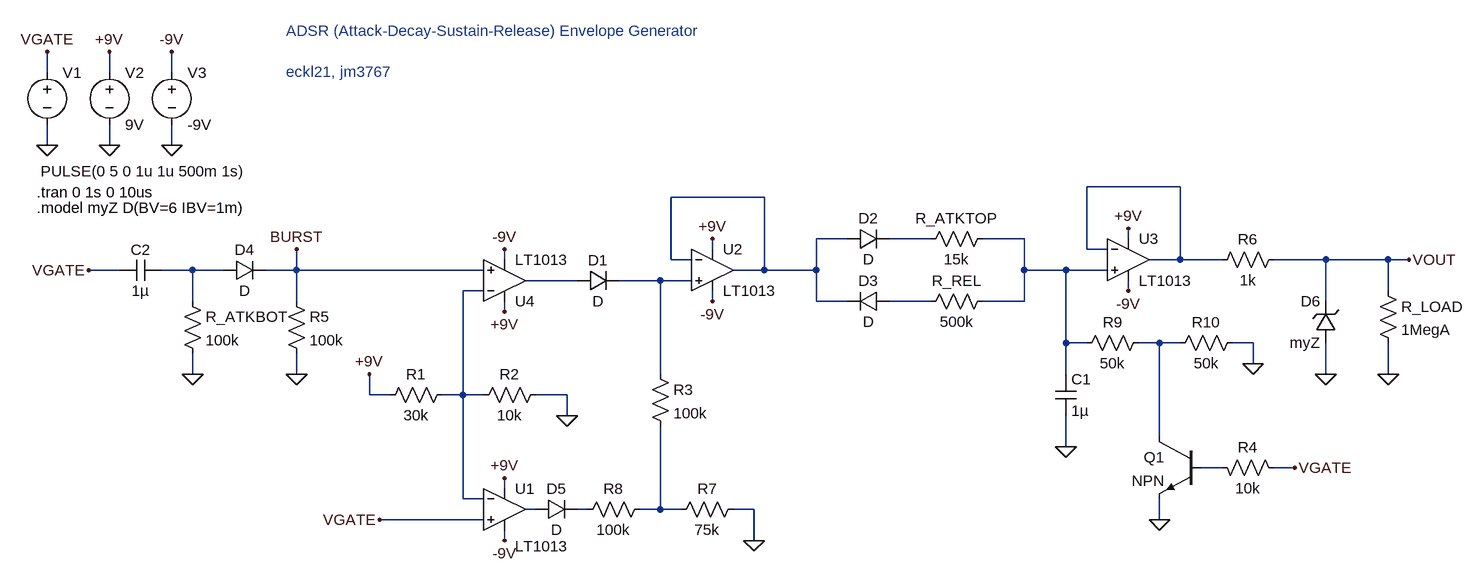
[diagram p0: schematic 260307-Synthesizer-EEE-ADSRENV-v3-00.asc]
260307-Synthesizer-EEE-ADSRENV-v3-00.asc, the LTspice schematic file:
Version 4.1
SHEET 1 2440 680
WIRE 48 -320 48 -352
WIRE 144 -320 144 -352
WIRE 240 -320 240 -352
WIRE 48 -208 48 -240
WIRE 144 -208 144 -240
WIRE 240 -208 240 -240
WIRE 1792 -144 1648 -144
WIRE 1152 -128 1008 -128
WIRE 1280 -64 1232 -64
WIRE 1408 -64 1344 -64
WIRE 1552 -64 1488 -64
WIRE 1712 -64 1712 -80
WIRE 1072 -48 1072 -64
WIRE 1648 -48 1648 -144
WIRE 1680 -48 1648 -48
WIRE 752 -32 752 -48
WIRE 1008 -32 1008 -128
WIRE 1040 -32 1008 -32
WIRE 1792 -32 1792 -144
WIRE 1792 -32 1744 -32
WIRE 1856 -32 1792 -32
WIRE 2016 -32 1936 -32
WIRE 2112 -32 2016 -32
WIRE 2144 -32 2112 -32
WIRE 160 -16 112 -16
WIRE 272 -16 224 -16
WIRE 320 -16 272 -16
WIRE 432 -16 432 -48
WIRE 432 -16 384 -16
WIRE 720 -16 432 -16
WIRE 1152 -16 1152 -128
WIRE 1152 -16 1104 -16
WIRE 1232 -16 1232 -64
WIRE 1232 -16 1152 -16
WIRE 1552 -16 1552 -64
WIRE 1616 -16 1552 -16
WIRE 1680 -16 1616 -16
WIRE 864 0 784 0
WIRE 992 0 928 0
WIRE 1040 0 992 0
WIRE 720 16 688 16
WIRE 1712 16 1712 0
WIRE 2112 16 2112 -32
WIRE 272 32 272 -16
WIRE 432 32 432 -16
WIRE 1072 32 1072 16
WIRE 1232 32 1232 -16
WIRE 1280 32 1232 32
WIRE 1408 32 1344 32
WIRE 1552 32 1552 -16
WIRE 1552 32 1488 32
WIRE 2016 32 2016 -32
WIRE 752 48 752 32
WIRE 1616 96 1616 -16
WIRE 1648 96 1616 96
WIRE 1760 96 1728 96
WIRE 1792 96 1760 96
WIRE 1904 96 1872 96
WIRE 1904 128 1904 96
WIRE 272 144 272 112
WIRE 432 144 432 112
WIRE 992 144 992 0
WIRE 1616 144 1616 96
WIRE 2016 144 2016 96
WIRE 2112 144 2112 96
WIRE 544 176 544 144
WIRE 576 176 544 176
WIRE 688 176 688 16
WIRE 688 176 656 176
WIRE 720 176 688 176
WIRE 848 176 800 176
WIRE 848 208 848 176
WIRE 1760 240 1760 96
WIRE 1616 256 1616 208
WIRE 1856 288 1824 288
WIRE 1968 288 1936 288
WIRE 752 320 752 304
WIRE 688 336 688 176
WIRE 720 336 688 336
WIRE 800 352 784 352
WIRE 880 352 864 352
WIRE 992 352 992 224
WIRE 992 352 960 352
WIRE 1024 352 992 352
WIRE 1136 352 1104 352
WIRE 720 368 560 368
WIRE 1760 368 1760 336
WIRE 752 400 752 384
WIRE 1136 400 1136 352
FLAG 48 -208 0
FLAG 48 -352 VGATE
FLAG 144 -208 0
FLAG 240 -208 0
FLAG 144 -352 +9V
FLAG 240 -352 -9V
FLAG 752 -48 -9V
FLAG 752 48 +9V
FLAG 848 208 0
FLAG 544 144 +9V
FLAG 1072 32 -9V
FLAG 1072 -64 +9V
FLAG 1712 -80 +9V
FLAG 560 368 VGATE
FLAG 752 304 +9V
FLAG 752 400 -9V
FLAG 2144 -32 VOUT
FLAG 1712 16 -9V
FLAG 272 144 0
FLAG 112 -16 VGATE
FLAG 432 144 0
FLAG 1136 400 0
FLAG 1760 368 0
FLAG 1616 256 0
FLAG 1968 288 VGATE
FLAG 1904 128 0
FLAG 432 -48 BURST
FLAG 2016 144 0
FLAG 2112 144 0
SYMBOL voltage 48 -336 R0
WINDOW 3 -10 168 Left 2
WINDOW 123 0 0 Left 0
WINDOW 39 0 0 Left 0
SYMATTR Value PULSE(0 5 0 1u 1u 500m 1s)
SYMATTR InstName V1
SYMBOL voltage 144 -336 R0
SYMATTR InstName V2
SYMATTR Value 9V
SYMBOL voltage 240 -336 R0
SYMATTR InstName V3
SYMATTR Value -9V
SYMBOL OpAmps\\LT1013 752 288 R0
WINDOW 3 16 121 Left 2
SYMATTR InstName U1
SYMBOL OpAmps\\LT1013 1072 -80 R0
SYMATTR InstName U2
SYMBOL OpAmps\\LT1013 1712 -96 R0
SYMATTR InstName U3
SYMBOL res 672 160 R90
WINDOW 0 0 56 VBottom 2
WINDOW 3 32 56 VTop 2
SYMATTR InstName R1
SYMATTR Value 30k
SYMBOL res 816 160 R90
WINDOW 0 0 56 VBottom 2
WINDOW 3 32 56 VTop 2
SYMATTR InstName R2
SYMATTR Value 10k
SYMBOL diode 864 16 R270
WINDOW 0 32 32 VTop 2
WINDOW 3 0 32 VBottom 2
SYMATTR InstName D1
SYMBOL res 976 128 R0
SYMATTR InstName R3
SYMATTR Value 100k
SYMBOL diode 1280 -48 R270
WINDOW 0 32 32 VTop 2
WINDOW 3 0 32 VBottom 2
SYMATTR InstName D2
SYMBOL diode 1344 16 R90
WINDOW 0 0 32 VBottom 2
WINDOW 3 32 32 VTop 2
SYMATTR InstName D3
SYMBOL res 1504 -80 R90
WINDOW 0 0 56 VBottom 2
WINDOW 3 32 56 VTop 2
SYMATTR InstName R_ATKTOP
SYMATTR Value 15k
SYMBOL cap 1600 144 R0
SYMATTR InstName C1
SYMATTR Value 1µ
SYMBOL res 2096 0 R0
SYMATTR InstName R_LOAD
SYMATTR Value 1MegA
SYMBOL res 1952 -48 R90
WINDOW 0 0 56 VBottom 2
WINDOW 3 32 56 VTop 2
SYMATTR InstName R6
SYMATTR Value 1k
SYMBOL OpAmps\\LT1013 752 64 M180
SYMATTR InstName U4
SYMBOL res 1120 336 R90
WINDOW 0 0 56 VBottom 2
WINDOW 3 32 56 VTop 2
SYMATTR InstName R7
SYMATTR Value 75k
SYMBOL res 1504 16 R90
WINDOW 0 0 56 VBottom 2
WINDOW 3 32 56 VTop 2
SYMATTR InstName R_REL
SYMATTR Value 500k
SYMBOL diode 800 368 R270
WINDOW 0 32 32 VTop 2
WINDOW 3 0 32 VBottom 2
SYMATTR InstName D5
SYMBOL cap 224 -32 R90
WINDOW 0 0 32 VBottom 2
WINDOW 3 32 32 VTop 2
SYMATTR InstName C2
SYMATTR Value 1µ
SYMBOL res 256 16 R0
SYMATTR InstName R_ATKBOT
SYMATTR Value 100k
SYMBOL diode 320 0 R270
WINDOW 0 32 32 VTop 2
WINDOW 3 0 32 VBottom 2
SYMATTR InstName D4
SYMBOL res 416 16 R0
SYMATTR InstName R5
SYMATTR Value 100k
SYMBOL res 976 336 R90
WINDOW 0 0 56 VBottom 2
WINDOW 3 32 56 VTop 2
SYMATTR InstName R8
SYMATTR Value 100k
SYMBOL npn 1824 240 M0
SYMATTR InstName Q1
SYMBOL res 1840 272 M90
WINDOW 0 0 56 VBottom 2
WINDOW 3 32 56 VTop 2
SYMATTR InstName R4
SYMATTR Value 10k
SYMBOL res 1744 80 R90
WINDOW 0 0 56 VBottom 2
WINDOW 3 32 56 VTop 2
SYMATTR InstName R9
SYMATTR Value 50k
SYMBOL res 1888 80 R90
WINDOW 0 0 56 VBottom 2
WINDOW 3 32 56 VTop 2
SYMATTR InstName R10
SYMATTR Value 50k
SYMBOL zener 2032 96 R180
WINDOW 0 24 64 Left 2
WINDOW 3 24 0 Left 2
SYMATTR InstName D6
SYMATTR Value myZ
TEXT 32 -136 Left 2 !.tran 0 1s 0 10us
TEXT 416 -384 Left 2 ;ADSR (Attack-Decay-Sustain-Release) Envelope Generator\n \neckl21, jm3767
TEXT 32 -112 Left 2 !.model myZ D(BV=6 IBV=1m)

The netlist it stands for:
* 260307-Synthesizer-EEE-ADSRENV-v3-00.asc
V1 VGATE 0 PULSE(0 5 0 1u 1u 500m 1s)
V2 +9V 0 9V
V3 -9V 0 -9V
X§U1 VGATE N008 +9V -9V N012 LT1013  ; pins In+ In- V+ V- OUT
X§U2 N007 N002 +9V -9V N002 LT1013  ; pins In+ In- V+ V- OUT
X§U3 N004 N001 +9V -9V N001 LT1013  ; pins In+ In- V+ V- OUT
R1 N008 +9V 30k
R2 0 N008 10k
D1 N006 N007 D
R3 N007 N014 100k
D2 N002 N003 D
D3 N009 N002 D
R_ATKTOP N004 N003 15k
C1 N004 0 1µ
R_LOAD VOUT 0 1MegA
R6 VOUT N001 1k
X§U4 BURST N008 +9V -9V N006 LT1013  ; pins In+ In- V+ V- OUT
R7 0 N014 75k
R_REL N004 N009 500k
D5 N012 N013 D
C2 N005 VGATE 1µ
R_ATKBOT N005 0 100k
D4 N005 BURST D
R5 BURST 0 100k
R8 N014 N013 100k
Q1 N010 N011 0 0 NPN
R4 N011 VGATE 10k
R9 N010 N004 50k
R10 0 N010 50k
D6 0 VOUT myZ
.model D D
.lib standard.dio
.model NPN NPN
.model PNP PNP
.lib standard.bjt
.tran 0 1s 0 10us
* ADSR (Attack-Decay-Sustain-Release) Envelope Generator
* eckl21, jm3767
.model myZ D(BV=6 IBV=1m)
.lib LTC.lib
.backanno
.end